# Altium project conversor_DC_DC.PrjPcb
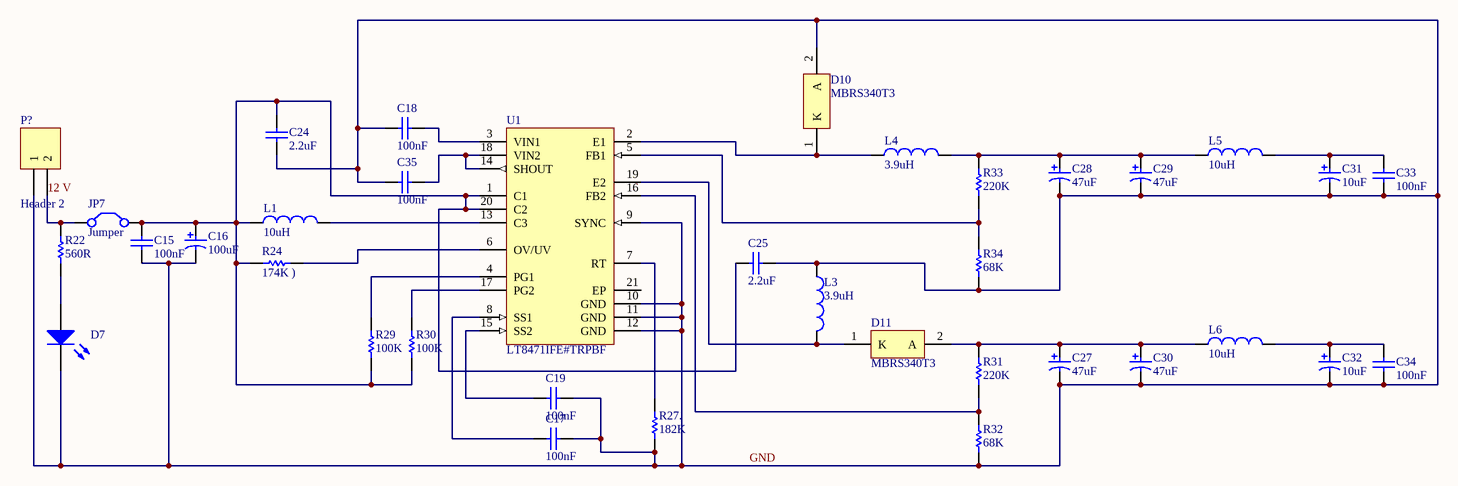
[diagram p0: conversor.SchDoc]
1 sheet, 36 parts. Net scope: global (net labels, ports and power ports of the same name join across sheets).

## Sheet conversor.SchDoc
size A4

### Parts
C15  100nF  [CAPC0805(2012)145_N]
C16  100uF  [CAPAE7067X55L]
C17  100nF  [CAPC0805(2012)145_N]
C18  100nF  [CAPC0805(2012)100_N]
C19  100nF  [CAPC0805(2012)145_N]
C24  2.2uF  [CAPC0805(2012)145_L]
C25  2.2uF  [CAPC0805(2012)145_L]
C27  47uF  [PNSC-EEE-HA1H470XP-2_V]
C28  47uF  [PNSC-EEE-HA1H470XP-2_V]
C29  47uF  [PNSC-EEE-HA1H470XP-2_V]
C30  47uF  [PNSC-EEE-HA1H470XP-2_V]
C31  10uF  [PNSC-EEE1CA100SR_L]
C32  10uF  [PNSC-EEE1CA100SR_L]
C33  100nF  [CAPC0805(2012)145_N]
C34  100nF  [CAPC0805(2012)145_N]
C35  100nF  [CAPC0805(2012)100_N]
D7  (no value)  [0805_A]
D10  MBRS340T3  [ONSC-SMC-2-403-03_V]
D11  MBRS340T3  [ONSC-SMC-2-403-03_V]
JP7  Jumper  [RAD-0.2]
L1  10uH  [BOUR-SDR0604_V]
L3  3.9uH  [BOUR-SDR0604_V]
L4  3.9uH  [BOUR-SDR0604_V]
L5  10uH  [BOUR-SDR0604_V]
L6  10uH  [BOUR-SDR0604_V]
P?  Header 2  [HDR1X2]
R22  560R  [RESC0805(2012)_M]
R24  174K )  [RESC0805(2012)_L]
R27.  182K  [RESC0805(2012)_M]
R29  100K  [RESC0805(2012)_L]
R30  100K  [RESC0805(2012)_L]
R31  220K  [RESC0805(2012)_N]
R32  68K  [RESC0805(2012)_M]
R33  220K  [RESC0805(2012)_N]
R34  68K  [RESC0805(2012)_M]
U1  LT8471IFE#TRPBF  [LT-FE-20-EPV-CB_M]

### Nets
12 V: JP7.1(C1) P?.2 R22.2
GND: C15.1 C16.2 C17.1 C18.1 C19.1 C24.2 C25.1 C27.2 C28.2 C29.2 C30.2 C31.2 C32.2 C33.1 C34.1 C35.1 D7.1(K) D10.2(A) L3.1 P?.1 R27..1 R32.1 R34.1 U1.9(SYNC) U1.10(GND) U1.11(GND) U1.12(GND)
NetC15_2: C15.2 C16.1 C24.1 C25.2 JP7.2(C2) L1.1 R24.1 R29.1 R30.1 U1.1(C1) U1.20(C2)
NetC17_2: C17.2 U1.8(SS1)
NetC18_2: C18.2 U1.3(VIN1)
NetC19_2: C19.2 U1.15(SS2)
NetC27_1: C27.1 C30.1 D11.2(A) L6.1 R31.2
NetC28_1: C28.1 C29.1 L4.2 L5.1 R33.2
NetC31_1: C31.1 C33.2 L5.2
NetC32_1: C32.1 C34.2 L6.2
NetC35_2: C35.2 U1.14(SHOUT) U1.18(VIN2)
NetD7_2: D7.2(A) R22.1
NetD10_1: D10.1(K) L4.1 U1.2(E1)
NetD11_1: D11.1(K) L3.2 U1.19(E2)
NetL1_2: L1.2 U1.13(C3)
NetR24_2: R24.2 U1.6(OV/UV)
NetR27._2: R27..2 U1.7(RT)
NetR29_2: R29.2 U1.4(PG1)
NetR30_2: R30.2 U1.17(PG2)
NetR31_1: R31.1 R32.2 U1.16(FB2)
NetR33_1: R33.1 R34.2 U1.5(FB1)

Not connected (* = marked no-connect by the designer): U1 21(EP)

### Library data of the parts
C15 C17 C19 C33 C34 = CMP-1036-04431-1: CAP 100nF 100V ±20% 0805 (2012 Metric) Thickness 1.45mm SMD; Case-Metric: 2012; Tolerance: Â±20%; Case-EIA: 0805; Value: 100nF; Technology: SMT; Rated Voltage: 100 V; Max Thickness: 1.45 mm
C16 = CMP-2000-07374-1: Aluminum Electrolytic Capacitor, 100 uF, +/- 20%, 16 V, -40 to 85 degC, 2-Pin SMD, RoHS, Tape and Reel; Manufacturer: Nichicon; Type: Can; Rated Voltage: 16V; Capacitance: 100µF; Case Size/Dimension: Ø6.3x5.4mm; Mounting Technology: SurfaceMount; Datasheet Version: 08/2015; Operating Temp-Max: 85°C; Datasheet URL: http://nichicon-us.com/english/products/pdfs/e-uwx.pdf; Package Description: 2-Pin Surface Mount Device, Body 6.6 x 6.6 mm; Package Reference: CAPAE7067X55; Manufacturer URL: http://www.nichicon.co.jp/english/
C18 C35 = CMP-1036-04411-1: CAP 100nF 25V ±10% 0805 (2012 Metric) Thickness 1mm SMD; Case-EIA: 0805; Case-Metric: 2012; Tolerance: Â±10%; Max Thickness: 1 mm; Rated Voltage: 25 V; Technology: SMT; Value: 100nF
C24 C25 = CMP-1036-04831-1: CAP 2.2uF 16V ±10% 0805 (2012 Metric) Thickness 1.45mm SMD; Case-Metric: 2012; Tolerance: Â±10%; Case-EIA: 0805; Value: 2.2uF; Max Thickness: 1.45 mm; Technology: SMT; Rated Voltage: 16 V
C27-C30 = CMP-0736-00001-1: Aluminum Electrolytic Capacitor, 47 uF +/- 20%, 50 V, -40 to 105 degC, 2-Pin 6.6 x 6.6 x 8 mm SMD, RoHS, Tape and Reel, Tape and Reel; PartNumber: EEE-HA1H470XP; Manufacturer: Panasonic; Capacitance Tolerance: +/- 20%; Ripple Current: 63 mA; Rated Voltage: 50 V; PackageReference: EEE-HA1H470XP-2; ComponentLink3Description: Package Specification; ComponentLink3URL: http://industrial.panasonic.com/www-data/pdf/ABA0000/ABA0000PE248.pdf; ComponentLink2Description: Datasheet; Mounting Technology: Surface Mount; Cap.: 47 uF; DatasheetVersion: Sep-13; ComponentLink1URL: http://industrial.panasonic.com/; Temp. Range: -40 to 105 degC; PackageVersion: Sep-13; ComponentLink1Description: Manufacturer URL; Packing: Tape and Reel; ComponentLink2URL: http://industrial.panasonic.com/www-data/pdf/ABA0000/ABA0000CE3.pdf; PackageDescription: 2-Pin SMD, Body 6.6 x 6.6 mm, Height 8 mm; RoHS: TRUE
C31 C32 = CMP-2000-06199-1: Aluminum Electrolytic Capacitor, 10 uF, +/- 20%, -40 to 85 degC, 2-Pin SMD, RoHS, Tape and Reel; Manufacturer: Panasonic; Lead Length: 1.8mm; No. of Pins: 2; Ripple Current Frequency: 120Hz; Ripple Current Temperature: 85°C; External Depth: 4.3mm; Operating Lifetime: 2000h; Power Factor: 0.16; Lead Cross-section Width: 0.65mm; Product Range: PANASONIC-SSeries; Voltage Rating V DC: 16V; Leakage Current: 3µA; Ripple Current AC: 28mA; AE Capacitor Case: RadialCan-SMD; Capacitance: 10µF; Lifetime @ Temperature: 2000hours@85°C; External Length / Height: 5.4mm; SVHC: NoSVHC(16-Dec-2013); Packaging: CutTape; Series: VS; Package Description: 2-Pin Surface Mount Device, Body 4.5 x 4.5 mm; Tolerance -: 20%; Capacitor Terminals: SMD; Lead Spacing: 1mm; Package / Case: B; Capacitance Tolerance: ±20%; Operating life Time: 2000h; Tape Width: 12mm; Power Factor Frequency: 120Hz; Voltage Rating: 16V; Diameter: 4mm; Operating Temperature Max: 85°C; Datasheet URL: https://datasheet.ciiva.com/19458/1355487-19458346.pdf; Capacitor Mounting: SMD; External Width: 4.3mm; Operating Life Temperature: 85°C; Capacitance Tolerance ±: ±20%; Package Reference: EEE1CA100SR; AC Ripple Current: 28mA; Tolerance +: 20%; Height: 5.4mm; Datasheet Version: 04/2005; Operating Temperature Min: -40°C; Capacitor Case Style: RadialCan-SMD; Mounting Technology: SurfaceMount; Operating Temperature Range: -40°Cto+85°C; Manufacturer URL: http://www.panasonic.com/; Life Time @ Temperature: 2000hours@85°C
D7 = CMP-1426-00008-1: SMD mono-color Chip LED, WL-SMCW, Blue; Manufacturer: Wuerth Elektronik; PartNumber: 150080BS75000; Color: Blue; ComponentLink2URL: http://katalog.we-online.com/led/datasheet/150080BS75000.pdf; ComponentLink1URL: http://www.we-online.com; ComponentLink2Description: Datasheet; PackageReference: 0805_A; ComponentLink1Description: Manufacturer URL
D10 D11 = CMP-1055-00395-1: Schottky Power Rectifier, 2-Pin SMC, Tape and Reel; Manufacturer: On Semiconductor; Configuration: Single; IFSM Max (A): 80; DatasheetVersion: Rev. 11; ComponentLink2URL: http://www.onsemi.cn/pub_link/Collateral/MBRS340T3-D.PDF; PartNumber: MBRS340T3; ComponentLink2Description: Datasheet; Packing: Tape and Reel; RoHS: FALSE; PackageDescription: 2-Pin Small Molded Package, J-Bend Lead, Body 5.845 x 6.855 mm; ComponentLink1URL: http://www.onsemi.com/; ComponentLink1Description: Manufacturer URL; PackageVersion: Rev. E, 08/2005; ComponentLink3Description: Package Specification; PackageReference: SMC-2-403-03; ComponentLink3URL: http://www.onsemi.com/pub_link/Collateral/403-03.PDF; Mounting Technology: Surface Mount
JP7 = Jumper: Jumper Wire; Published: 24-Mar-1999; LatestRevisionDate: 17-Jul-2002; LatestRevisionNote: Re-released for DXP Platform.; PackageReference: RAD-0.2; Publisher: Altium Limited; PackageDescription: Radial Cap, Thru-Hole; 2 Leads; 0.2 in Pin Spacing
L1 L5 L6 = CMP-2000-07040-1: Power Inductor, 10 uH, +/- 20%, -40 to 125 degC, 2-Pin SMD, RoHS, Tape and Reel; Manufacturer: Bourns; Maximum DC Current: 1.45A; Product Height: 4.8mm; Core Material: Ferrite; Maximum DC Resistance: 100mOhm; Rad Hard: No; Minimum Quality Factor: 30@2.52MHz; Datasheet URL: http://www.bourns.com/docs/Product-Datasheets/SDR0604.pdf; Package/Case: 5.8X4.8; Inductance: 10uH; Tolerance: 20%; Type: Power; Manufacturer URL: http://www.bourns.com/; Packaging: CutTape; Package Reference: SDR0604; Package Description: 2-Pin Surface Mount Device, Dia 5.8 mm; Mounting Technology: SurfaceMount; Datasheet Version: 05/2012
L3 L4 = CMP-2000-07040-1: Power Inductor, 10 uH, +/- 20%, -40 to 125 degC, 2-Pin SMD, RoHS, Tape and Reel; Manufacturer: Bourns; Inductance: 10uH; Maximum DC Current: 1.45A; Product Height: 4.8mm; Core Material: Ferrite; Maximum DC Resistance: 100mOhm; Rad Hard: No; Minimum Quality Factor: 30@2.52MHz; Datasheet URL: http://www.bourns.com/docs/Product-Datasheets/SDR0604.pdf; Package/Case: 5.8X4.8; Tolerance: 20%; Type: Power; Manufacturer URL: http://www.bourns.com/; Packaging: CutTape; Package Reference: SDR0604; Package Description: 2-Pin Surface Mount Device, Dia 5.8 mm; Mounting Technology: SurfaceMount; Datasheet Version: 05/2012
P? = Header 2: Header, 2-Pin; LatestRevisionDate: 17-Jul-2002; LatestRevisionNote: Re-released for DXP Platform.; Publisher: Altium Limited
R22 = CMP-1013-00482-1: 560R 0.125W 1% 0805 (2012 Metric)  SMD; Value: 560.00 Ohm; Case-Metric: 2012; Case-EIA: 0805; Technology: SMT; Tolerance: 1 %; Power: 0.125 W
R24 = CMP-1013-00761-1: 174K 0.125W 1% 0805 (2012 Metric)  SMD; Case-Metric: 2012; Case-EIA: 0805; Value: 174000.00 Ohm; Power: 0.125 W; Technology: SMT; Tolerance: 1 %
R27. = CMP-1013-00764-1: 182K 0.125W 1% 0805 (2012 Metric)  SMD; Case-Metric: 2012; Case-EIA: 0805; Value: 182000.00 Ohm; Technology: SMT; Power: 0.125 W; Tolerance: 1 %
R29 R30 = CMP-1013-00122-1: 100K 0.125W 5% 0805 (2012 Metric)  SMD; Case-Metric: 2012; Value: 100000.00 Ohm; Case-EIA: 0805; Tolerance: 5 %; Technology: SMT; Power: 0.125 W
R31 R33 = CMP-1013-00772-1: 220K 0.125W 1% 0805 (2012 Metric)  SMD; Value: 220000.00 Ohm; Case-EIA: 0805; Case-Metric: 2012; Power: 0.125 W; Tolerance: 1 %; Technology: SMT
R32 R34 = CMP-1013-00717-1: 68K 0.125W 1% 0805 (2012 Metric)  SMD; Case-EIA: 0805; Case-Metric: 2012; Value: 68000.00 Ohm; Tolerance: 1 %; Power: 0.125 W; Technology: SMT
U1 = CMP-0492-02704-1: Dual Multitopology DC/DC Converter with 2 A Switches and Synchronization, 2.6 to 50 V, -40 to 125 degC, 20-Pin TSSOP (FE), RoHS, Tape and Reel; Input Voltage Min: 2.6 V; Input Voltage Max: 50 V; RoHS: TRUE; ComponentLink2Description: Datasheet; ComponentLink2URL: http://cds.linear.com/docs/en/datasheet/8471fc.pdf; PartNumber: LT8471IFE#TRPBF; Temperature Min: -40 degC; ComponentLink3URL: http://cds.linear.com/docs/en/packaging/05081663_K_FE20(CB).pdf; ComponentLink1Description: Manufacturer URL; PackageDescription: 20-Pin Plastic Thin Shrink Small Outline Package, Body 6.5 x 4.4 mm, Pitch 0.65 mm; Mounting Technology: Surface Mount; Packing: Tape and Reel; PackageVersion: Rev. K, 04/2014; DatasheetVersion: Rev. C; ComponentLink3Description: Package Specification; ComponentLink1URL: http://www.linear.com/; Temperature Max: 125 degC